# Altium schematic sheet US_SB_GHW.SchDoc
size A4
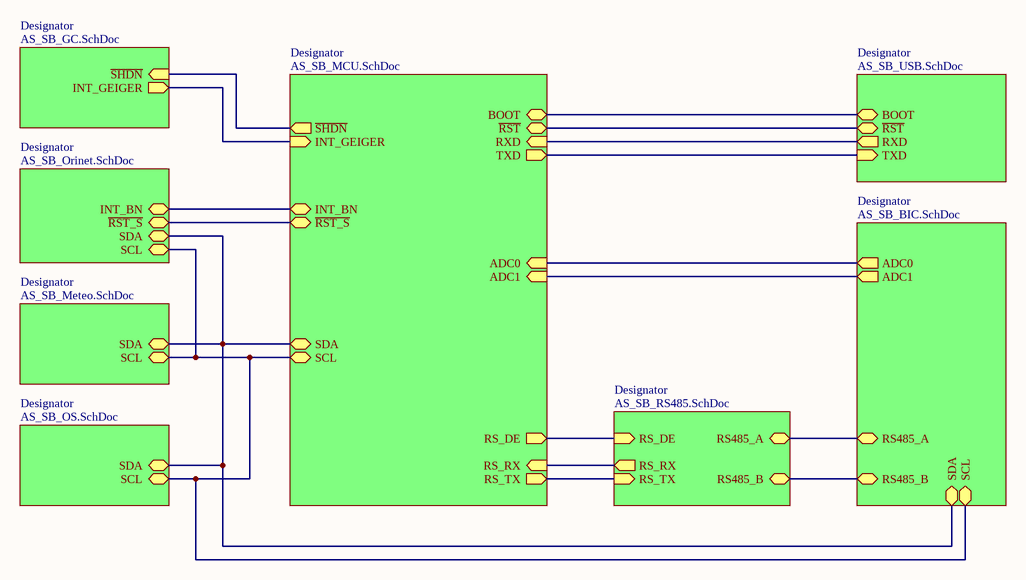
[diagram p0: US_SB_GHW.SchDoc]

## Sub-sheets
Designator = AS_SB_MCU.SchDoc: INT_BN, ~{SHDN} (out), INT_GEIGER (in), RS_DE (out), RS_RX (in), RS_TX (out), ADC1 (in), ADC0 (in), RXD (in), TXD (out), SDA (bidir), SCL (bidir), ~{RST}, BOOT, ~{RST_S}
Designator = AS_SB_USB.SchDoc: RXD (out), TXD (in), ~{RST}, BOOT
Designator = AS_SB_Orinet.SchDoc: SDA (bidir), SCL (bidir), INT_BN, ~{RST_S}
Designator = AS_SB_Meteo.SchDoc: SDA (bidir), SCL (bidir)
Designator = AS_SB_OS.SchDoc: SDA (bidir), SCL (bidir)
Designator = AS_SB_GC.SchDoc: ~{SHDN} (in), INT_GEIGER (out)
Designator = AS_SB_RS485.SchDoc: RS_DE (in), RS_RX (out), RS_TX (in), RS485_A, RS485_B
Designator = AS_SB_BIC.SchDoc: RS485_A, RS485_B, SCL (bidir), SDA (bidir), ADC1 (out), ADC0 (out)

## Nets
(unnamed): sheet Designator/INT_BN, sheet Designator/INT_BN
(unnamed): sheet Designator/~{SHDN}, sheet Designator/~{SHDN}
(unnamed): sheet Designator/INT_GEIGER, sheet Designator/INT_GEIGER
(unnamed): sheet Designator/RS_DE, sheet Designator/RS_DE
(unnamed): sheet Designator/RS_RX, sheet Designator/RS_RX
(unnamed): sheet Designator/RS_TX, sheet Designator/RS_TX
(unnamed): sheet Designator/ADC1, sheet Designator/ADC1
(unnamed): sheet Designator/ADC0, sheet Designator/ADC0
(unnamed): sheet Designator/RXD, sheet Designator/RXD
(unnamed): sheet Designator/TXD, sheet Designator/TXD
(unnamed): sheet Designator/SDA, sheet Designator/SDA, sheet Designator/SDA, sheet Designator/SDA, sheet Designator/SDA
(unnamed): sheet Designator/SCL, sheet Designator/SCL, sheet Designator/SCL, sheet Designator/SCL, sheet Designator/SCL
(unnamed): sheet Designator/~{RST}, sheet Designator/~{RST}
(unnamed): sheet Designator/BOOT, sheet Designator/BOOT
(unnamed): sheet Designator/~{RST_S}, sheet Designator/~{RST_S}
(unnamed): sheet Designator/RS485_A, sheet Designator/RS485_A
(unnamed): sheet Designator/RS485_B, sheet Designator/RS485_B